# EAGLE design mini64-v0.9.8 (EAGLE 5.11)
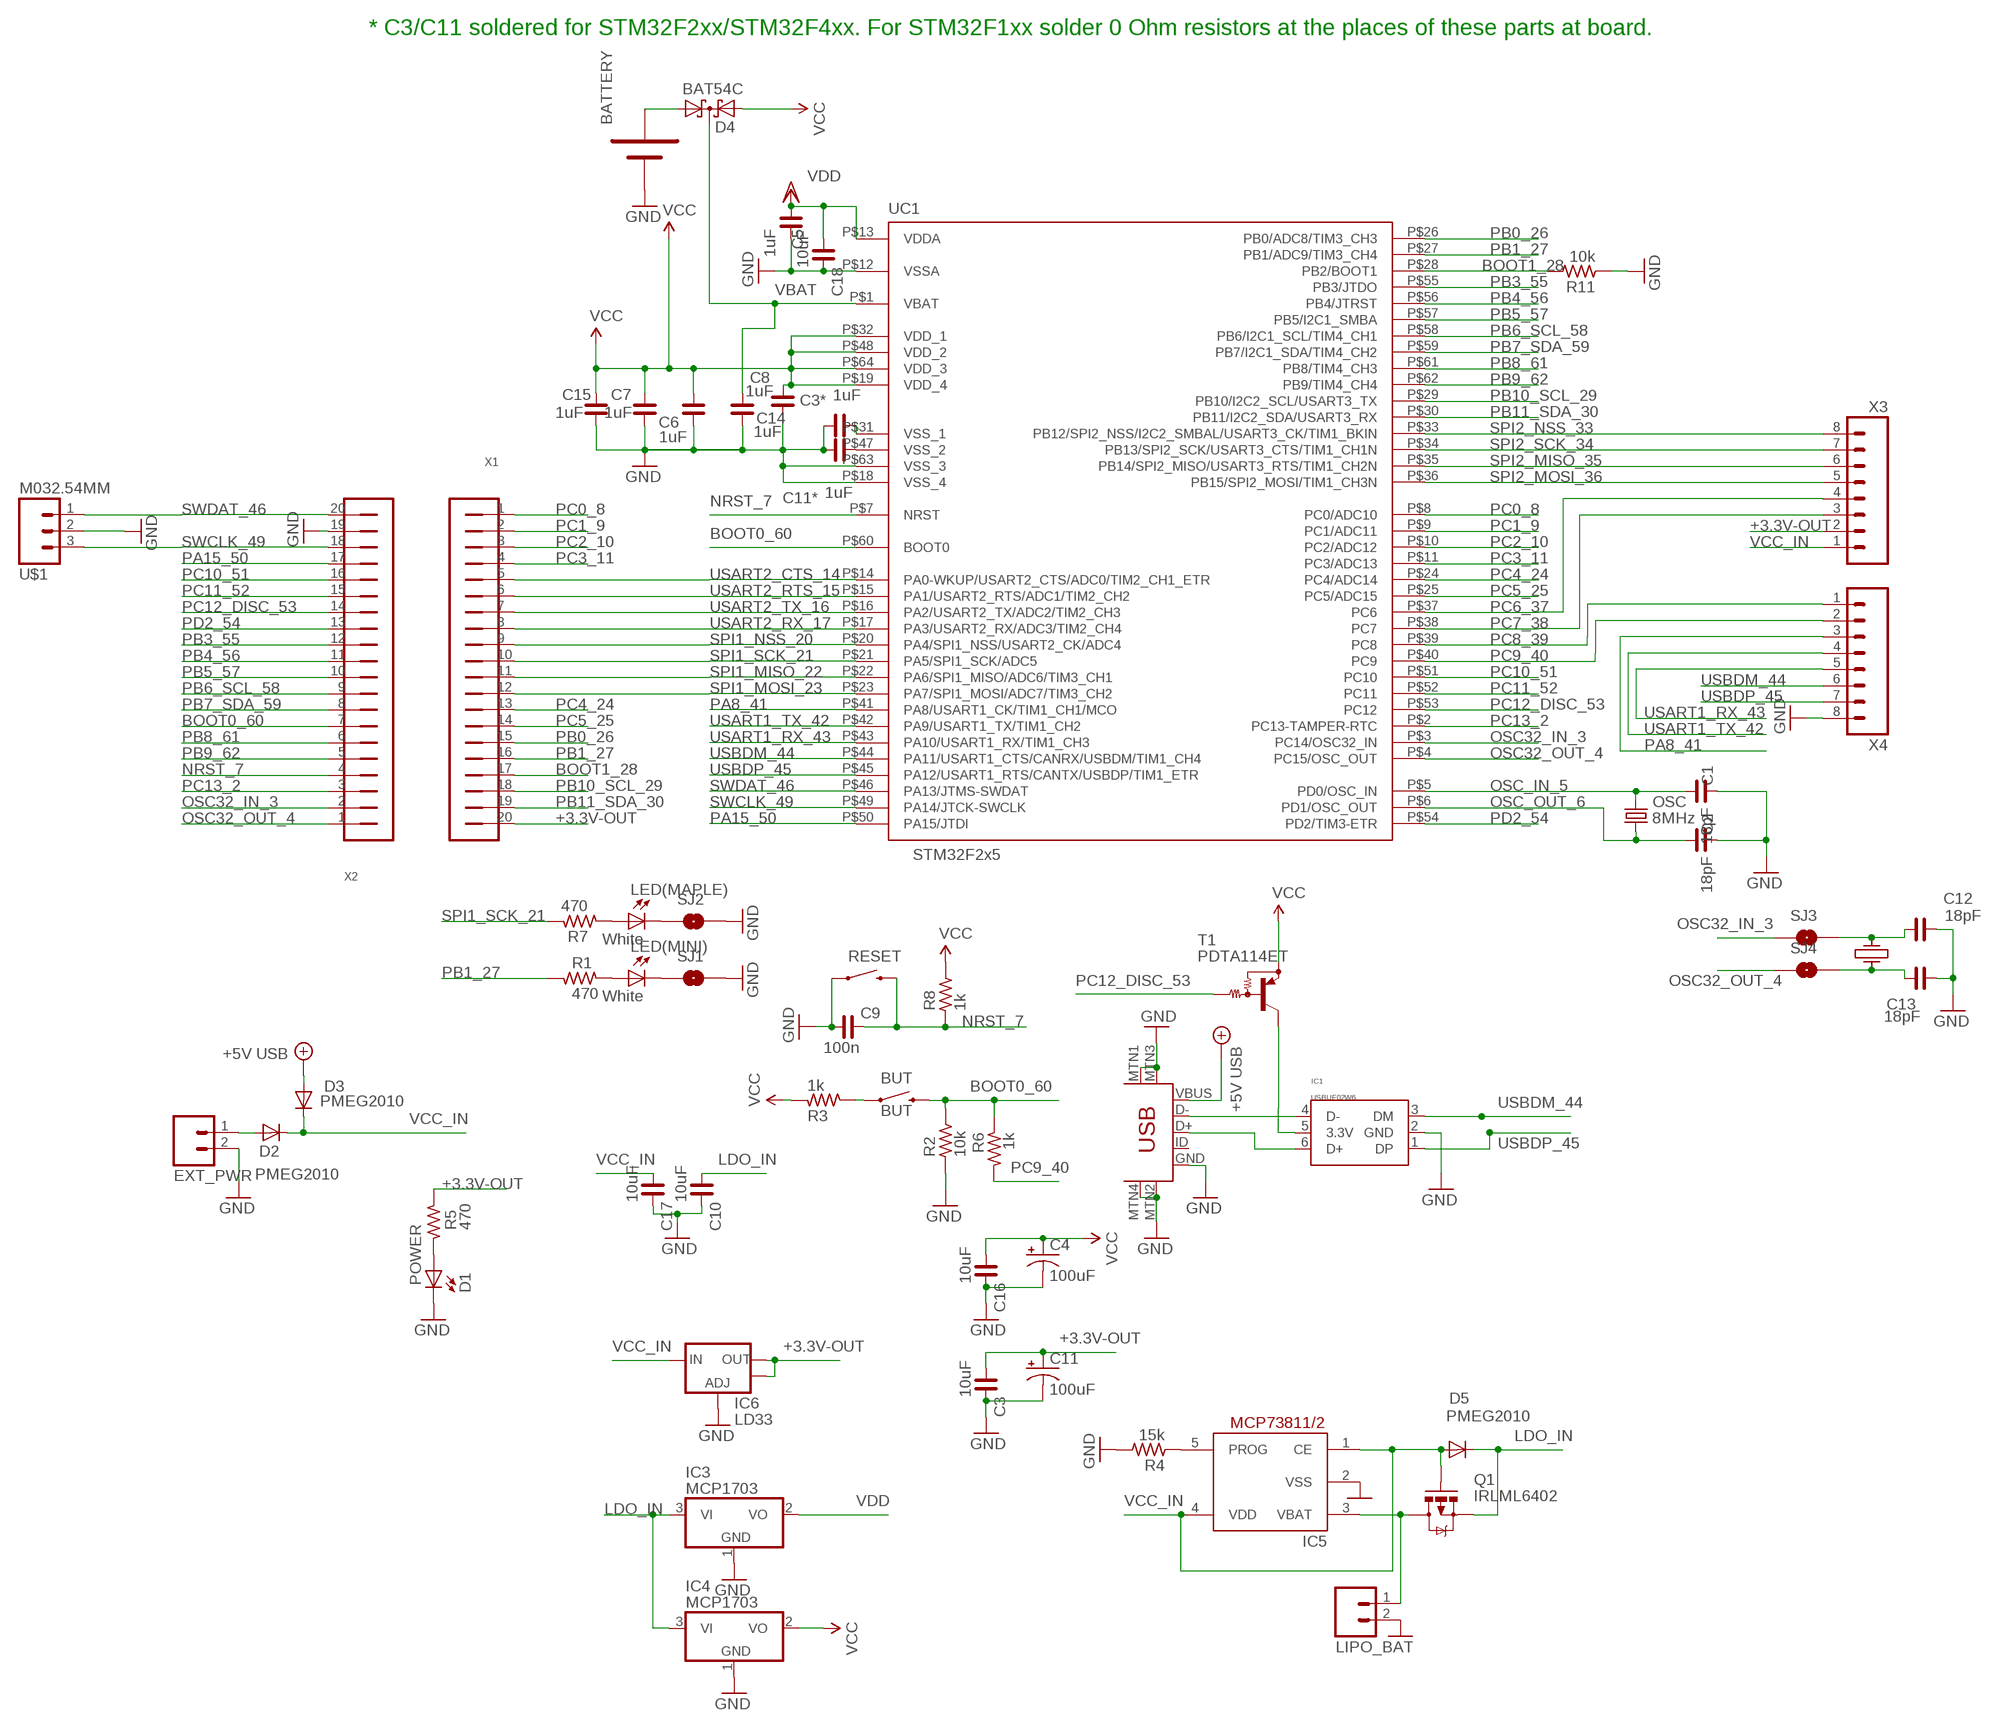
[diagram p0: schematic, sheet 1]

## Parts
BATTERY  BATTERY-1XAA20MM  [BATTCOM_20MM_PTH]
BUT  BUT  SWITCH-MOMENTARY-2-SMD-1101NE  [TACTILE-SWITCH-1101NE]
C1  18pF  C_0603  [C0603]
C2  18pF  C_0603  [C0603]
C3  10uF  C_0805  [C0805]
C3*  1uF  C_0603  [C0603]
C4  100uF  CAP_POL3528  [EIA3528]
C5  1uF  C_0603  [C0603]
C6  1uF  C_0603  [C0603]
C7  1uF  C_0603  [C0603]
C8  1uF  C_0603  [C0603]
C9  100n  C_0603  [C0603]
C10  10uF  C_0805  [C0805]
C11  100uF  CAP_POL3528  [EIA3528]
C11*  1uF  C_0603  [C0603]
C12  18pF  C_0603  [C0603]
C13  18pF  C_0603  [C0603]
C14  1uF  C_0603  [C0603]
C15  1uF  C_0603  [C0603]
C16  10uF  C_0805  [C0805]
C17  10uF  C_0805  [C0805]
C18  10uF  C_0805  [C0805]
D1  POWER  LEDCHIP-LED0603  [CHIP-LED0603]
D2  PMEG2010  DIODESOD-323  [SOD-323]
D3  PMEG2010  DIODESOD-323  [SOD-323]
D4  BAT54C  BAT54CRS  [SOT23-3]
D5  PMEG2010  DIODESOD-323  [SOD-323]
EXT_PWR  M021X02_NO_SILK  [1X02_NO_SILK]
IC1  USBUF02W6  [SC70-6]
IC3  MCP1703  [SOT23-3]
IC4  MCP1703  [SOT23-3]
IC5  MCP73811/2  [SOT23-5L]
IC6  LD33  V_REG_LM1117SOT223  [SOT223]
LED(MAPLE)  White  LEDCHIP-LED0603  [CHIP-LED0603]
LED(MINI)  White  LEDCHIP-LED0603  [CHIP-LED0603]
LIPO_BAT  M021X02_NO_SILK  [1X02_NO_SILK]
OSC  8MHz  CRYSTAL5X3  [CRYSTAL-SMD-5X3]
OSC2  32768kHz  CRYSTALL  [KX-327LT]
Q1  IRLML6402  MOSFET-PCHANNELSMD  [SOT23-3]
R1  470  R_0603  [R0603]
R2  10k  R_0603  [R0603]
R3  1k  R_0603  [R0603]
R4  15k  R_0603  [R0603]
R5  470  R_0603  [R0603]
R6  1k  R_0603  [R0603]
R7  470  R_0603  [R0603]
R8  1k  R_0603  [R0603]
R11  10k  R_0603  [R0603]
RESET  SWITCH-MOMENTARY-2-SMD-1101NE  [TACTILE-SWITCH-1101NE]
SJ1  SOLDERJUMPERTRACE  [SJ_2S-TRACE]
SJ2  SOLDERJUMPERTRACE  [SJ_2S-TRACE]
SJ3  SOLDERJUMPERTRACE  [SJ_2S-TRACE]
SJ4  SOLDERJUMPERTRACE  [SJ_2S-TRACE]
T1  PDTA114ET  PNP-DRIVERSOT23-3  [SOT23-3]
U$1  M032.54MM  M031X03_NO_SILK  [1X03_NO_SILK]
UC1  STM32F2x5  STM32F103  [TQFP-10X10-64]
USB  USB-MINIB-5PIN  [USB-MINIB]
X1  M20NO_SILK  [1X20_NO_SILK]
X2  M20NO_SILK  [1X20_NO_SILK]
X3  M08  [1X08-NOSILK]
X4  M08  [1X08-NOSILK]

## Nets
+3.3V-OUT [vcc]: C3.1 C11.A(+) IC6.2(OUT) IC6.4(OUT) R5.1 X1.20 X3.2
+5V [vcc]: D3.A USB.VBUS ; supply symbol labelled +5V USB
BOOT0_60: BUT.P$2 R2.2 R6.1 UC1.P$60(BOOT0) X2.7
BOOT1_28: R11.2 UC1.P$28(PB2/BOOT1) X1.17
GND [vcc]: BATTERY.- C1.1 C2.1 C3*.2 C3.2 C4.C(-) C5.1 C6.1 C7.1 C8.1 C9.1 C10.2 C11*.2 C11.C(-) C12.1 C13.1 C14.1 C15.1 C16.2 C17.2 C18.2 D1.C EXT_PWR.2 IC1.2(GND) IC3.1(GND) IC4.1(GND) IC5.2(VSS) IC6.1(ADJ) LIPO_BAT.2 R2.1 R4.2 R11.1 RESET.P$1 SJ1.2 SJ2.2 U$1.2 UC1.P$12(VSSA) UC1.P$18(VSS_4) UC1.P$63(VSS_3) USB.GND USB.MTN1(MTN2) USB.MTN2(MTN3) USB.MTN3(MTN1) USB.MTN4 X2.19 X4.8
LDO_IN [vcc]: C10.1 D5.C IC3.3(VI) IC4.3(VI) Q1.2(S)
N$1: D1.A R5.2
N$2: BUT.P$1 R3.2
N$3: LED(MINI).A R1.1
N$4: LED(MINI).C SJ1.1
N$5: LED(MAPLE).A R7.2
N$6: LED(MAPLE).C SJ2.1
N$7: C11*.1 UC1.P$47(VSS_2)
N$8: BATTERY.+ D4.1(A1)
N$9: C3*.1 UC1.P$31(VSS_1)
N$10: C13.2 OSC2.4 SJ4.2
N$11 [vcc]: D2.A EXT_PWR.1
N$12: C12.2 OSC2.1 SJ3.2
N$13: IC5.5(PROG) R4.1
N$14: IC1.4(D-) USB.D-
N$16 [vcc]: IC5.3(VBAT) LIPO_BAT.1 Q1.3(D)
N$17: IC1.6(D+) USB.D+
N$51: IC1.5(3.3V) T1.3(C)
NRST_7: C9.2 R8.1 RESET.P$2 UC1.P$7(NRST) X2.4
OSC32_IN_3: SJ3.1 UC1.P$3(PC14/OSC32_IN) X2.2
OSC32_OUT_4: SJ4.1 UC1.P$4(PC15/OSC_OUT) X2.1
OSC_IN_5: C1.2 OSC.3 UC1.P$5(PD0/OSC_IN)
OSC_OUT_6: C2.2 OSC.1 UC1.P$6(PD1/OSC_OUT)
PA8_41: UC1.P$41(PA8/USART1_CK/TIM1_CH1/MCO) X4.3
PA15_50: UC1.P$50(PA15/JTDI) X2.17
PB0_26: UC1.P$26(PB0/ADC8/TIM3_CH3) X1.15
PB1_27: R1.2 UC1.P$27(PB1/ADC9/TIM3_CH4) X1.16
PB3_55: UC1.P$55(PB3/JTDO) X2.12
PB4_56: UC1.P$56(PB4/JTRST) X2.11
PB5_57: UC1.P$57(PB5/I2C1_SMBA) X2.10
PB6_SCL_58: UC1.P$58(PB6/I2C1_SCL/TIM4_CH1) X2.9
PB7_SDA_59: UC1.P$59(PB7/I2C1_SDA/TIM4_CH2) X2.8
PB8_61: UC1.P$61(PB8/TIM4_CH3) X2.6
PB9_62: UC1.P$62(PB9/TIM4_CH4) X2.5
PB10_SCL_29: UC1.P$29(PB10/I2C2_SCL/USART3_TX) X1.18
PB11_SDA_30: UC1.P$30(PB11/I2C2_SDA/USART3_RX) X1.19
PC0_8: UC1.P$8(PC0/ADC10) X1.1
PC1_9: UC1.P$9(PC1/ADC11) X1.2
PC2_10: UC1.P$10(PC2/ADC12) X1.3
PC3_11: UC1.P$11(PC3/ADC13) X1.4
PC4_24: UC1.P$24(PC4/ADC14) X1.13
PC5_25: UC1.P$25(PC5/ADC15) X1.14
PC6_37: UC1.P$37(PC6) X3.4
PC7_38: UC1.P$38(PC7) X3.3
PC8_39: UC1.P$39(PC8) X4.1
PC9_40: R6.2 UC1.P$40(PC9) X4.2
PC10_51: UC1.P$51(PC10) X2.16
PC11_52: UC1.P$52(PC11) X2.15
PC12_DISC_53: T1.1(B) UC1.P$53(PC12) X2.14
PC13_2: UC1.P$2(PC13-TAMPER-RTC) X2.3
PD2_54: UC1.P$54(PD2/TIM3-ETR) X2.13
SPI1_MISO_22: UC1.P$22(PA6/SPI1_MISO/ADC6/TIM3_CH1) X1.11
SPI1_MOSI_23: UC1.P$23(PA7/SPI1_MOSI/ADC7/TIM3_CH2) X1.12
SPI1_NSS_20: UC1.P$20(PA4/SPI1_NSS/USART2_CK/ADC4) X1.9
SPI1_SCK_21: R7.1 UC1.P$21(PA5/SPI1_SCK/ADC5) X1.10
SPI2_MISO_35: UC1.P$35(PB14/SPI2_MISO/USART3_RTS/TIM1_CH2N) X3.6
SPI2_MOSI_36: UC1.P$36(PB15/SPI2_MOSI/TIM1_CH3N) X3.5
SPI2_NSS_33: UC1.P$33(PB12/SPI2_NSS/I2C2_SMBAL/USART3_CK/TIM1_BKIN) X3.8
SPI2_SCK_34: UC1.P$34(PB13/SPI2_SCK/USART3_CTS/TIM1_CH1N) X3.7
SWCLK_49: U$1.3 UC1.P$49(PA14/JTCK-SWCLK) X2.18
SWDAT_46: U$1.1 UC1.P$46(PA13/JTMS-SWDAT) X2.20
USART1_RX_43: UC1.P$43(PA10/USART1_RX/TIM1_CH3) X4.5
USART1_TX_42: UC1.P$42(PA9/USART1_TX/TIM1_CH2) X4.4
USART2_CTS_14: UC1.P$14(PA0-WKUP/USART2_CTS/ADC0/TIM2_CH1_ETR) X1.5
USART2_RTS_15: UC1.P$15(PA1/USART2_RTS/ADC1/TIM2_CH2) X1.6
USART2_RX_17: UC1.P$17(PA3/USART2_RX/ADC3/TIM2_CH4) X1.8
USART2_TX_16: UC1.P$16(PA2/USART2_TX/ADC2/TIM2_CH3) X1.7
USBDM_44: IC1.3(DM) UC1.P$44(PA11/USART1_CTS/CANRX/USBDM/TIM1_CH4) X4.6
USBDP_45: IC1.1(DP) UC1.P$45(PA12/USART1_RTS/CANTX/USBDP/TIM1_ETR) X4.7
VBAT: C8.2 D4.3(CC) UC1.P$1(VBAT)
VCC [vcc]: C4.A(+) C6.2 C7.2 C14.2 C15.2 C16.1 D4.2(A2) IC4.2(VO) R3.1 R8.2 T1.2(E) UC1.P$19(VDD_4) UC1.P$32(VDD_1) UC1.P$48(VDD_2) UC1.P$64(VDD_3)
VCC_IN [vcc]: C17.1 D2.C D3.C D5.A IC5.1(CE) IC5.4(VDD) IC6.3(IN) Q1.1(G) X3.1
VDD [vcc]: C5.2 C18.1 IC3.2(VO) UC1.P$13(VDDA)
Unconnected: USB.ID

## Notes on the sheet
- * C3/C11 soldered for STM32F2xx/STM32F4xx. For STM32F1xx solder 0 Ohm resistors at the places of these parts at board.

## Library data of the parts
BATTERY = es:BATTERY-1XAA
BUT RESET = SparkFun_20110922_my:SWITCH-MOMENTARY-2
C1-C3 C3* C5-C10 C11* C12-C18 = rc-master-smd:C_: NON-POLARIZED CAP
C4 C11 = SparkFun_20110922_my:CAP_POL: Capacitor Polarized These are standard SMD and PTH capacitors. Normally 10uF, 47uF, and 100uF in electrolytic and tantalum varieties. Always verify the external diameter of the through hole cap, it varies with capacity, voltage, and manufacturer. The EIA devices should be standard.
D1 LED(MAPLE) LED(MINI) = led:LED: LED OSRAM: - CHIPLED LG R971, LG N971, LY N971, LG Q971, LY Q971, LO R971, LY R971 LH N974, LH R974 LS Q976, LO Q976, LY Q976 LO Q996 - Hyper CHIPLED LW Q18S LB Q993, LB Q99A, LB R99A - SideLED LS A670, LO A670, LY A670, LG A670, LP A670 LB A673, LV A673, LT A673, LW A673 LH A674 LY A675 LS A676, LA A676, LO A676, LY A676, LW A676 LS A679, LY A679, LG A679 - Hyper Micro SIDELED® LS Y876, LA Y876, LO Y876, LY Y876 LT Y87S - SmartLED LW L88C, LW L88S LB L89C, LB L89S, LG L890 LS L89K, LO L89K, LY L89K LS L896, LA L896, LO L896, LY L896 - TOPLED LS T670, LO T670, LY T670, LG T670, LP T670 LSG T670, LSP T670, LSY T670, LOP T670, LYG T670 LG T671, LOG T671, LSG T671 LB T673, LV T673, LT T673, LW T673 LH T674 LS T676, LA T676, LO T676, LY T676, LB T676, LH T676, LSB T676, LW T676 LB T67C, LV T67C, LT T67C, LS T67K, LO T67K, LY T67K, LW E67C LS E67B, LA E67B, LO E67B, LY E67B, LB E67C, LV E67C, LT E67C LW T67C LS T679, LY T679, LG T679 LS T770, LO T770, LY T770, LG T770, LP T770 LB T773, LV T773, LT T773, LW T773 LH T774 LS E675, LA E675, LY E675, LS T675 LS T776, LA T776, LO T776, LY T776, LB T776 LHGB T686 LT T68C, LB T68C - Hyper Mini TOPLED® LB M676 - Mini TOPLED Santana® LG M470 LS M47K, LO M47K, LY M47K Source: http://www.osram.convergy.de LUXEON: - LUMILED® LXK2-PW12-R00, LXK2-PW12-S00, LXK2-PW14-U00, LXK2-PW14-V00 LXK2-PM12-R00, LXK2-PM12-S00, LXK2-PM14-U00 LXK2-PE12-Q00, LXK2-PE12-R00, LXK2-PE12-S00, LXK2-PE14-T00, LXK2-PE14-U00 LXK2-PB12-K00, LXK2-PB12-L00, LXK2-PB12-M00, LXK2-PB14-N00, LXK2-PB14-P00, LXK2-PB14-Q00 LXK2-PR12-L00, LXK2-PR12-M00, LXK2-PR14-Q00, LXK2-PR14-R00 LXK2-PD12-Q00, LXK2-PD12-R00, LXK2-PD12-S00 LXK2-PH12-R00, LXK2-PH12-S00 LXK2-PL12-P00, LXK2-PL12-Q00, LXK2-PL12-R00 Source: www.luxeon.com KINGBRIGHT: KA-3528ASYC Source: www.kingbright.com
D2 D3 D5 = adafruit:DIODE: Diode SMADIODE - SMA Surface Mount Package 20V 1A Schottky Diode Digikey: 641-1014-6-ND DO-1N4148 - Through Hole Small Current Diode SOD-123 20V 1 A (.5mV Vf) Schottky Diode - Digikey: MBRX120TPMSCT-ND SOD-323 10V 570mA (.38mV Vf, 3ns) Schottky Diode - Digikey: ZLLS410CT-ND SOD-523 30V 30mA Schottky Diode (RB751S-40TE61) - Digikey: RB751S-40TE61CT-ND SOT23-R/W - SOT23 Package (R = Solder Paste/Reflow Ovens, W = Hand-Soldering) BAT54Film 40V 300mA - Digikey: 497-7162-1-ND
D4 = es:BAT54C: Schottky Diodes Source: Fairchild .. BAT54.pdf
EXT_PWR LIPO_BAT = SparkFun_20110922_my:M02: Header 2 Standard 2-pin 0.1" header. Use with straight break away headers (SKU : PRT-00116), right angle break away headers (PRT-00553), swiss pins (PRT-00743), machine pins (PRT-00117), and female headers (PRT-00115). Molex polarized connector foot print use with SKU : PRT-08233 with associated crimp pins and housings.
IC1 = es:USBUF
IC3 IC4 = es:MCP1703: 250 mA, 16V, Low Quiescent Current LDO Regulator Source: http://ww1.microchip.com/downloads/en/DeviceDoc/22049b.pdf
IC5 = adafruit_my:MCP73811/2: MCP73811 and MCP73812 Simple, Miniature Single-Cell, Fully Integrated Li-Ion / Li-Polymer Charge Management Controllers SOT-23-5 package, no indicator LED but with adjustable current, small and very inexpensive
IC6 = SparkFun_20110922_my:V_REG_LM1117: Voltage Regulator LM1117 Standard adjustable voltage regulator but in SMD form. Spark Fun Electronics SKU : COM-00595
OSC = SparkFun:CRYSTAL: Crystals Various standard crystals. Proven footprints. Spark Fun Electronics SKU : COM-00534
OSC2 = es:CRYSTALL
Q1 = es:MOSFET-PCHANNEL
R1-R8 R11 = rc-master-smd:R_: RESISTOR
SJ1-SJ4 = es:SOLDERJUMPER: Solder Jumper Standard SMD solder jumper. Used to automate production. Two varients : Normally Open and Normally Closed are the same, but have different paste layers. NC will have a large amount of paste and should jumper during reflow.
T1 = es:PNP-DRIVER
U$1 = SparkFun_20110922_my:M03: Header 3 Standard 3-pin 0.1" header. Use with straight break away headers (SKU : PRT-00116), right angle break away headers (PRT-00553), swiss pins (PRT-00743), machine pins (PRT-00117), and female headers (PRT-00115). Molex polarized connector foot print use with SKU : PRT-08232 with associated crimp pins and housings.
UC1 = st-microelectronics:STM32F103
USB = SparkFun_20110922_my:USB-MINIB: Mini-USB "B" connector with 5th pin broken out. Created new symbol breaking out 5th "ID" pin in mini/micro USB connector spec. See: http://en.wikipedia.org/wiki/Mini_usb#Cables. Uses same footprint as 4-pin symbol. Also added pins to connect to mounting / shield pads if required (probably not generally needed as signals aren't shielded once they leave the connector).
X1 X2 = es:M20
X3 X4 = SparkFun_20110922_my:M08: Header 8 Standard 8-pin 0.1" header. Use with straight break away headers (SKU : PRT-00116), right angle break away headers (PRT-00553), swiss pins (PRT-00743), machine pins (PRT-00117), and female headers (PRT-00115).

## Net classes
1 vcc: width 0.3 mm

## Board
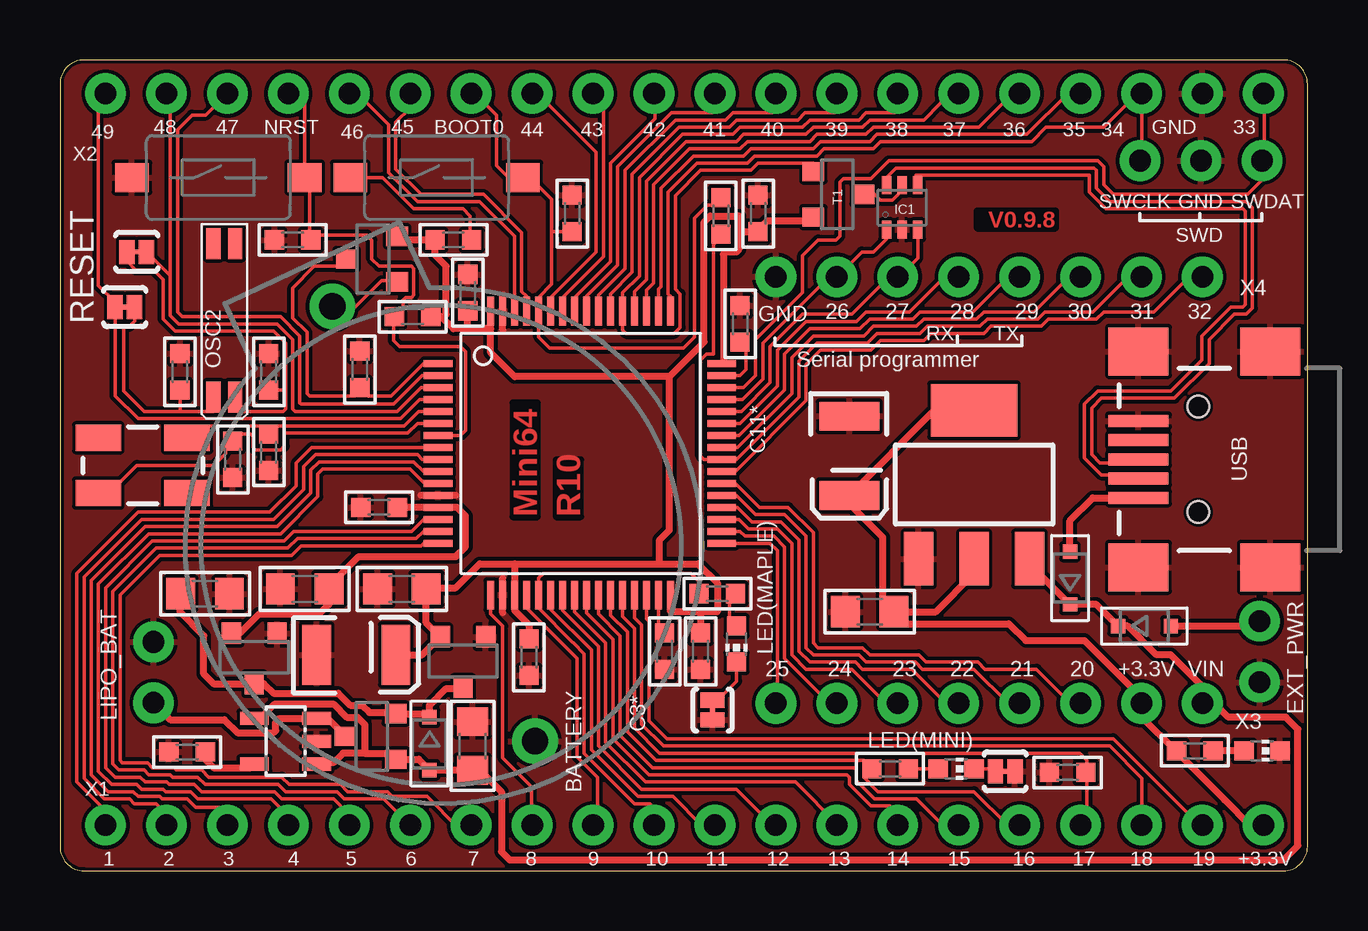
[diagram p1: board, top side]

Size 52 x 33.8 mm. Coordinates in mm from the lower left corner, seen from the top.
Outline: 51,0 arc90 52,1 52,32.8 arc90 51,33.8 1,33.8 arc90 0,32.8 0,1 arc90 1,0 51,0
Copper layers (1*16): Top 0.018mm / dielectric 1.5mm / Bottom 0.018mm
Design rules "es-015mm *": minimum track width 0.15mm, minimum drill 0.4mm, track to track 0.15mm, track to pad 0.15mm, pad to pad 0.15mm, via to via 0.15mm, smd to smd 0.15mm, copper to edge 0.15mm, drill to drill 0.15mm, minimum pad ring 0.4mm, minimum via ring 0.3mm, stop-mask expansion 0mil, vias tented up to drill 25mil, thermal gap 0.15mm

### Footprints (pad centres in the part's own frame; a part is rotated, then mirrored left to right if it is on the bottom)
BATTCOM_20MM_PTH = drill 1.1 round: + 20,0; - 0,0
TACTILE-SWITCH-1101NE = smd 1.4 x 1.2: P$1 -3.6,0; P$2 3.6,0
C0603 = smd 0.8 x 0.8: 1 -0.762,0; 2 0.762,0
C0805 = smd 1.2 x 1.3: 1 -1.016,0; 2 1.016,0
EIA3528 = smd 1.2 x 2.5: A 1.65,0; C -1.65,0
CHIP-LED0603 = smd 0.8 x 0.8: A 0,-0.75; C 0,0.75
SOD-323 = smd 0.6 x 0.6: A 1.1,0; C -1.1,0
SOT23-3 = smd 0.8 x 0.9: 1 -0.95,-1; 2 0.95,-1; 3 0,1.1
1X02_NO_SILK = drill 0.9 round: 1 0,0; 2 2.54,0
SC70-6 = smd 0.4 x 0.75: 1 -0.65,-0.925; 2 0,-0.925; 3 0.65,-0.925; 4 0.65,0.925; 5 0,0.925; 6 -0.65,0.925
SOT23-5L = smd 0.55 x 1.2: 1 -0.95,-1.3; 2 0,-1.3; 3 0.95,-1.3; 4 0.95,1.3; 5 -0.95,1.3
SOT223 = smd 1.219 x 2.235: 1 -2.311,-3.099; 2 0,-3.099; 3 2.311,-3.099 | smd 3.6 x 2.2: 4 0,3.099
CRYSTAL-SMD-5X3 = smd 1.9 x 1.1: 1 -1.85,-1.15; 2 1.85,-1.15; 3 1.85,1.15; 4 -1.85,1.15
KX-327LT = smd 1.3 x 0.6: 1 -3.2,-0.5; 2 3.2,-0.5; 3 3.2,0.4; 4 -3.2,0.4
R0603 = smd 0.8 x 0.8: 1 -0.762,0; 2 0.762,0
SJ_2S-TRACE = smd 0.635 x 1: 1 -0.408,0; 2 0.408,0 | smd 0.406 x 0.203: P$1 0,0
1X03_NO_SILK = drill 0.9 round: 1 0,0; 2 2.54,0; 3 5.08,0
TQFP-10X10-64 = smd 1.2 x 0.3: P$1 -5.936,3.75; P$2 -5.936,3.25; P$3 -5.936,2.75; P$4 -5.936,2.25; P$5 -5.936,1.75; P$6 -5.936,1.25; P$7 -5.936,0.75; P$8 -5.936,0.25; P$9 -5.936,-0.25; P$10 -5.936,-0.75; P$11 -5.936,-1.25; P$12 -5.936,-1.75; P$13 -5.936,-2.25; P$14 -5.936,-2.75; P$15 -5.936,-3.25; P$16 -5.936,-3.75; P$33 5.886,-3.75; P$34 5.886,-3.25; P$35 5.886,-2.75; P$36 5.886,-2.25; P$37 5.886,-1.75; P$38 5.886,-1.25; P$39 5.886,-0.75; P$40 5.886,-0.25; P$41 5.886,0.25; P$42 5.886,0.75; P$43 5.886,1.25; P$44 5.886,1.75; P$45 5.886,2.25; P$46 5.886,2.75; P$47 5.886,3.25; P$48 5.886,3.75 | smd 0.3 x 1.2: P$17 -3.75,-5.911; P$18 -3.25,-5.911; P$19 -2.75,-5.911; P$20 -2.25,-5.911; P$21 -1.75,-5.911; P$22 -1.25,-5.911; P$23 -0.75,-5.911; P$24 -0.25,-5.911; P$25 0.25,-5.911; P$26 0.75,-5.911; P$27 1.25,-5.911; P$28 1.75,-5.911; P$29 2.25,-5.911; P$30 2.75,-5.911; P$31 3.25,-5.911; P$32 3.75,-5.911; P$49 3.75,5.936; P$50 3.25,5.936; P$51 2.75,5.936; P$52 2.25,5.936; P$53 1.75,5.936; P$54 1.25,5.936; P$55 0.75,5.936; P$56 0.25,5.936; P$57 -0.25,5.936; P$58 -0.75,5.936; P$59 -1.25,5.936; P$60 -1.75,5.936; P$61 -2.25,5.936; P$62 -2.75,5.936; P$63 -3.25,5.936; P$64 -3.75,5.936
USB-MINIB = smd 2.5 x 0.5: D+ 2.5,0; D- 2.5,0.8; GND 2.5,-1.6; ID 2.5,-0.8; VBUS 2.5,1.6 | smd 2.5 x 2: MTN1 -3,4.5; MTN2 2.5,4.5; MTN3 -3,-4.5; MTN4 2.5,-4.5 | hole 0.9: 0,2.2; 0,-2.2
1X20_NO_SILK = drill 0.9 round: 1 0,0; 2 2.54,0; 3 5.08,0; 4 7.62,0; 5 10.16,0; 6 12.7,0; 7 15.24,0; 8 17.78,0; 9 20.32,0; 10 22.86,0; 11 25.4,0; 12 27.94,0; 13 30.48,0; 14 33.02,0; 15 35.56,0; 16 38.1,0; 17 40.64,0; 18 43.18,0; 19 45.72,0; 20 48.26,0
1X08-NOSILK = drill 0.9 round: 1 0,0; 2 2.54,0; 3 5.08,0; 4 7.62,0; 5 10.16,0; 6 12.7,0; 7 15.24,0; 8 17.78,0

### Placement (x,y rotation side)
BATTERY  19.8,5.4 115 top
BUT  15.7,28.9 0 top
C1  8.7,17.45 90 top
C2  7.2,17.15 90 top
C3  33.75,10.8 180 top
C3*  25.2,9.15 270 top
C4  12.35,9 0 top
C5  13.3,15.15 0 top
C6  29.1,27.4 270 top
C7  26.7,9.15 90 top
C8  12.5,20.9 270 top
C9  9.7,26.3 0 top
C10  6.05,11.55 0 top
C11  32.9,17.3 270 top
C11*  28.35,22.8 90 top
C12  8.7,20.8 270 top
C13  5,20.8 270 top
C14  17,24.1 270 top
C15  19.55,8.9 90 top
C16  14.25,11.75 180 top
C17  17.2,5.2 90 top
C18  10.2,11.75 180 top
D1  50.1,5 270 top
D2  45.2,10.2 0 top
D3  42.1,12.2 90 top
D4  13.05,25.5 90 top
D5  15.4,5.3 270 top
EXT_PWR  50,10.4 270 top
IC1  35.1,27.65 0 top
IC3  8.1,8.9 180 top
IC4  16.8,8.75 180 top
IC5  9.4,5.4 90 top
IC6  38.1,16.1 0 top
LED(MAPLE)  28.2,9.45 180 top
LED(MINI)  37.35,4.25 270 top
LIPO_BAT  3.9,7 90 top
OSC  3.45,16.9 0 top
OSC2  6.8,22.95 90 top
Q1  13,5.6 90 top
R1  34.6,4.25 180 top
R2  21.35,27.4 270 top
R3  16.4,26.3 0 top
R4  5.3,4.95 180 top
R5  47.3,5 0 top
R6  27.55,27.3 270 top
R7  27.4,11.55 0 top
R8  14.7,23.1 0 top
R11  42,4.1 0 top
RESET  6.6,28.9 0 top
SJ1  39.4,4.15 0 top
SJ2  27.2,6.7 270 top
SJ3  3.2,25.8 180 top
SJ4  2.7,23.5 0 top
T1  32.4,28.2 270 top
U$1  50.1,29.6 180 top
UC1  21.7,17.4 0 top
USB  47.45,17.15 180 top
X1  1.9,1.9 0 top
X2  1.9,32.4 0 top
X3  47.62,6.98 180 top
X4  47.62,24.76 180 top

### Tracks (layer width: path | path; a pad name or v marks a point on that pad's centre or on a via)
+3.3V-OUT
  Top 0.3: 46.5,5 45.08,6.42 X3.2 45.08,7.22 45,7.3 42.7,9.6 40.25,9.6 39.55,10.3 35.27,10.3 C3.1 | 46.5,5 48.55,2.95 49.6,1.9 X1.20 | IC6.4 36.45,19.2 C11.A 32.9,15.3 34.3,13.9 34.3,11.27 C3.1 | C3.1 36.5,10.8 38.1,12.4 IC6.2 | 46.5,5 R5.1
+5V
  Top 0.3: USB.VBUS 43.05,15.55 42.1,14.6 D3.A
BOOT0_60
  Top 0.15: R6.1 27.29,27.8 27.29,27.75 27,27.75 26.45,27.2 26.45,22.25 26,21.8 20.4,21.8 19.95,22.25 UC1.P$60 19.95,23.9 20.5,24.45 20.5,26.6 | 20.5,26.6 20.5,28 19.6,28.9 BUT.P$2 18.7,28.9 18.2,29.4 18.2,31.5 17.3,32.4 X2.7 | R2.2 20.54,26.64 20.5,26.6
BOOT1_28
  Top 0.15: UC1.P$28 23.45,10.6 23.95,10.1 23.95,5.95 25,4.9 28.6,4.9 42.5,4.9 42.8,4.6 42.8,4.1 | 42.8,4.1 42.8,1.9 X1.17 | 42.8,4.1 R11.2
GND
  Top 0.3: 18.45,10.75 18.45,12.2 | 18.45,22.55 18.45,24 | 16.5,15.65 15.05,15.65
  pour Top (isolate 0.12): -0.05,34.55 -0.05,-0.05 52.35,-0.05 52.35,34.55
LDO_IN
  Top 0.3: IC4.3 16.75,7.6 16.1,7.6 15.4,6.9 D5.C 15.25,6.55 Q1.2 13.95,6.6 12.9,6.6 12.6,6.9 12.1,6.9 11.6,7.4 8.9,7.4 8.5,7.8 IC3.3 6.4,7.8 6,8.2 6,9.8 5,10.8 5,11.52 C10.1
N$1
  Top 0.3: D1.A R5.2
N$2
  Top 0.15: BUT.P$1 13.45,28.9 14.75,27.6 16.8,27.6 17.1,27.3 17.1,26.36 R3.2
N$3
  Top 0.15: R1.1 LED(MINI).A
N$4
  Top 0.15: LED(MINI).C 39.09,4.25 SJ1.1
N$5
  Top 0.15: LED(MAPLE).A 28.1,10.2 27.9,10.4 27.9,11.29 R7.2
N$6
  Top 0.15: SJ2.1 27.41,7.11 28.2,7.9 LED(MAPLE).C
N$7
  Top 0.15: UC1.P$47 28.35,20.65 28.6,20.9 28.6,21.79 C11*.1
N$8
  Top 0.15: BATTERY.+ 12.33,23.53 13.4,24.6 14,24.6 D4.1
N$9
  Top 0.15: UC1.P$31 24.95,10.16 C3*.1
N$10
  Top 0.15: SJ4.2 3.11,22.91 2.9,22.7 2.65,22.7 2.65,20 3.5,19.15 5,19.15 | 5,19.15 6.4,19.15 OSC2.4 | 5,19.15 C13.2
N$11
  Top 0.3: D2.A 49.8,10.2 EXT_PWR.1
N$12
  Top 0.15: SJ3.2 2.79,25.41 3.15,25.05 3.9,25.05 4.3,24.65 4.3,23 4.8,22.5 8.9,22.5 9.4,22 9.4,20.1 | 9.4,20.1 9.4,19.25 9.3,19.15 7.4,19.15 7.3,19.25 OSC2.1 | C12.2 9.34,20.04 9.4,20.1
N$13
  Top 0.3: R4.1 6.06,4.64 6.4,4.3 7.95,4.3 IC5.5
N$14
  Top 0.15: USB.D- 43.95,16.35 43.8,16.5 43.4,16.5 42.7,17.2 42.7,19.45 43.25,20 46.3,20 47.6,21.3 47.6,22.3 48.8,23.5 49.3,23.5 49.4,23.6 49.4,27.5 49.3,27.6 43.6,27.6 42.9,28.3 42.9,29 35.67,29 35.67,28.65 IC1.4
N$16
  Top 0.3: Q1.3 11.15,6.35 IC5.3 9.15,6.35 9,6.2 9,5.85 8.9,5.75 7.4,5.75 6.85,6.3 4.6,6.3 LIPO_BAT.1
N$17
  Top 0.15: USB.D+ 44.05,17.15 43.9,17 43.35,17 43,17.35 43,19.3 43.4,19.7 46.45,19.7 47.9,21.15 47.9,22.15 48.95,23.2 49.45,23.2 49.7,23.45 49.7,27.65 49.45,27.9 43.75,27.9 43.2,28.45 43.2,29.2 43.1,29.3 34.85,29.3 34.45,28.9 IC1.6
N$51
  Top 0.15: T1.3 33.95,28.2 34.2,27.95 34.7,27.95 35.1,28.35 IC1.5
NRST_7
  Top 0.15: UC1.P$7 16.7,18.15 16.9,18.35 16.9,21.65 16.7,21.85 14.15,21.85 13.9,22.1 13.9,23.06 R8.1 14.3,23.46 14.3,23.8 14.4,23.9 14.65,23.9 14.75,24 14.75,25.1 14.65,25.2 13.3,25.2 13,25.5 13,26.3 12.8,26.5 10.66,26.5 C9.2 10.4,26.36 10.4,28.7 RESET.P$2 10.2,32 9.8,32.4 X2.4
OSC32_IN_3
  Top 0.15: UC1.P$3 15.05,20.15 14.05,19.15 9.8,19.15 9.7,19.25 9.7,22.15 9.05,22.8 4.95,22.8 4.6,23.15 4.6,24.8 | 4.6,24.8 4.6,24.81 SJ3.1 | 4.6,24.8 4.6,32.2 4.44,32.36 X2.2
OSC32_OUT_4
  Top 0.15: UC1.P$4 15,19.65 14.2,18.85 3.25,18.85 2.3,19.8 SJ4.1 2.29,23.71 1.6,24.4 1.6,32.1 X2.1
OSC_IN_5
  Top 0.15: UC1.P$5 14.95,19.15 14.35,18.55 8.7,18.55 | 8.7,18.55 5.3,18.55 OSC.3 | 8.7,18.55 C1.2
OSC_OUT_6
  Top 0.15: UC1.P$6 14.9,18.65 14.5,18.25 9.35,18.25 9.35,17.7 9.2,17.55 8.15,17.55 8.05,17.65 8.05,18.1 7.95,18.2 7.49,18.2 C2.2 7.19,17.91 6.9,18.2 6.9,17.4 6.4,16.9 3.2,16.9 2.4,16.1 1.95,16.1 OSC.1
PA8_41
  Top 0.15: UC1.P$41 28.25,17.65 30.5,19.9 30.5,21.4 31.4,22.3 33.5,22.3 33.9,22.7 35.7,22.7 36,23 38.2,23 38.5,23.3 40.6,23.3 42.1,24.8 42.5,24.8 X4.3
PA15_50
  Top 0.15: UC1.P$50 24.95,24.25 25.05,24.35 25.05,28.45 26.4,29.8 28.5,29.8 28.8,30.1 31.4,30.1 31.7,30.4 33.75,30.4 34.05,30.7 40.3,30.7 42,32.4 X2.17
PB0_26
  Top 0.15: UC1.P$26 22.45,10.7 23.35,9.8 23.35,5.65 24.7,4.3 33.1,4.3 33.2,4.2 33.2,3.75 33.95,3 35.7,3 36.8,1.9 X1.15
PB1_27
  Top 0.15: UC1.P$27 22.95,10.65 23.65,9.95 23.65,5.8 24.85,4.6 33.5,4.6 33.5,4.2 | X1.16 39.5,1.9 38.1,3.3 34.1,3.3 33.5,3.9 33.5,4.2 | R1.2 33.55,4.25 33.5,4.2
PB3_55
  Top 0.15: UC1.P$55 22.45,24 23.55,25.1 23.55,29.2 25.65,31.3 27.75,31.3 28.05,31.6 29.7,31.6 29.8,31.7 29.8,32.36 X2.12
PB4_56
  Top 0.15: UC1.P$56 21.95,23.95 23.25,25.25 23.25,29.35 25.5,31.6 27.2,31.6 27.3,31.7 X2.11
PB5_57
  Top 0.15: UC1.P$57 21.45,23.9 22.95,25.4 22.95,29.5 24.8,31.35 24.8,32.34 24.8,32.36 X2.10
PB6_SCL_58
  Top 0.15: UC1.P$58 20.95,23.9 22.65,25.6 22.65,32.4 X2.9
PB7_SDA_59
  Top 0.15: UC1.P$59 20.45,23.9 22.35,25.8 22.35,29.95 19.9,32.4 X2.8
PB8_61
  Top 0.15: UC1.P$61 19.45,23.95 19.25,24.15 19.25,24.4 19.25,26.6 17.65,28.2 15.05,28.2 14,29.25 14,31.2 14.6,31.8 X2.6
PB9_62
  Top 0.15: UC1.P$62 18.95,24.25 18.95,26.45 17.5,27.9 14.9,27.9 13.7,29.1 13.7,31.1 12.4,32.4 X2.5
PB10_SCL_29
  Top 0.15: UC1.P$29 23.95,10.55 24.25,10.25 24.25,6.1 25.15,5.2 43.75,5.2 45.1,3.85 45.1,1.92 X1.18 45,1.9
PB11_SDA_30
  Top 0.15: UC1.P$30 24.45,10.5 24.55,10.4 24.55,6.25 25.3,5.5 43.9,5.5 47.5,1.9 X1.19
PC0_8
  Top 0.15: UC1.P$8 15.05,17.65 14.95,17.65 10.5,17.65 9.85,17 9.85,16.05 8.75,14.95 3.25,14.95 0.7,12.4 0.7,3.7 1.9,2.5 X1.1
PC1_9
  Top 0.15: UC1.P$9 15.1,17.15 14.9,17.35 10.65,17.35 10.15,16.85 10.15,15.9 8.9,14.65 3.4,14.65 1,12.25 1,3.85 1.85,3 2.9,3 3.1,2.8 4,2.8 4.4,2.4 4.4,1.94 X1.2
PC2_10
  Top 0.15: UC1.P$10 15.15,16.65 14.75,17.05 10.8,17.05 10.45,16.7 10.45,15.75 9.05,14.35 3.55,14.35 1.3,12.1 1.3,4 2,3.3 3.05,3.3 3.25,3.1 4.15,3.1 4.25,3 5.3,3 5.65,2.65 6.75,2.65 7,2.4 7,1.92 X1.3
PC3_11
  Top 0.15: UC1.P$11 15.2,16.15 14.6,16.75 10.95,16.75 10.75,16.55 10.75,15.6 9.2,14.05 3.7,14.05 1.6,11.95 1.6,4.15 2.15,3.6 3.2,3.6 3.4,3.4 4.3,3.4 4.4,3.3 5.45,3.3 5.75,3 8.8,3 9.5,2.3 9.5,1.92 X1.4
PC4_24
  Top 0.15: UC1.P$24 21.45,10.8 22.75,9.5 22.75,5.35 24.4,3.7 30.65,3.7 32.45,1.9 X1.13
PC5_25
  Top 0.15: UC1.P$25 21.95,10.75 23.05,9.65 23.05,5.5 24.55,4 32.8,4 32.9,3.9 32.9,3.6 33.8,2.7 34.6,2.7 34.75,2.55 34.75,1.9 X1.14
PC6_37
  Top 0.15: UC1.P$37 28.2,15.65 29,14.85 30.2,14.85 31.1,13.95 31.1,9.3 31.4,9 33.3,9 33.6,8.7 35.65,8.7 35.95,8.4 38.1,8.4 39.5,7 39.98,7 X3.4
PC7_38
  Top 0.15: UC1.P$38 28.15,16.15 29.15,15.15 30.35,15.15 31.4,14.1 31.4,9.5 31.6,9.3 33.45,9.3 33.75,9 35.8,9 36.1,8.7 38.25,8.7 38.55,8.4 40.7,8.4 42.1,7 42.52,7 X3.3
PC8_39
  Top 0.15: UC1.P$39 28.15,16.65 31.1,19.6 31.1,21.1 31.7,21.7 33.8,21.7 34.2,22.1 36,22.1 36.3,22.4 38.5,22.4 38.8,22.7 40.9,22.7 41.2,23 43.2,23 43.5,23.3 45.6,23.3 47.1,24.8 47.5,24.8 47.54,24.76 X4.1
PC9_40
  Top 0.15: R6.2 27.55,26.4 27.25,26.1 27.25,21.55 26.95,21.55 26.7,21.3 26.7,17.3 26.85,17.15 UC1.P$40 28.2,17.15 30.8,19.75 30.8,21.25 31.55,22 33.65,22 34.05,22.4 35.85,22.4 36.15,22.7 38.35,22.7 38.65,23 40.75,23 41.05,23.3 43.05,23.3 44.55,24.8 45.04,24.8 X4.2
PC10_51
  Top 0.15: UC1.P$51 24.45,24.2 24.75,24.5 24.75,28.6 26.25,30.1 28.35,30.1 28.65,30.4 31.25,30.4 31.55,30.7 33.6,30.7 33.9,31 38.3,31 39.1,31.8 39.7,32.4 X2.16
PC11_52
  Top 0.15: UC1.P$52 23.95,24.15 24.45,24.65 24.45,28.75 26.1,30.4 28.2,30.4 28.5,30.7 31.1,30.7 31.4,31 33.45,31 33.75,31.3 36,31.3 36.7,32 37.1,32.4 X2.15
PC12_DISC_53
  Top 0.15: T1.1 31.4,29.5 29.1,29.5 28.8,29.2 26.7,29.2 25.65,28.15 25.65,24.25 25.85,24.05 25.85,22.65 25.6,22.4 23.6,22.4 23.45,22.55 UC1.P$53 23.45,24.1 24.15,24.8 24.15,28.9 25.95,30.7 28.05,30.7 28.35,31 30.95,31 31.25,31.3 33.3,31.3 33.6,31.6 34.8,31.6 34.9,31.7 34.9,32.38 X2.14
PC13_2
  Top 0.15: UC1.P$2 15.1,20.65 13.9,19.45 10.05,19.45 10,19.5 10,22.3 9.2,23.1 5.1,23.1 4.9,23.3 4.9,30.9 5.5,31.5 6.08,31.5 X2.3
PD2_54
  Top 0.15: UC1.P$54 22.95,24.05 23.85,24.95 23.85,29.05 25.8,31 27.9,31 28.2,31.3 30.75,31.3 31.05,31.6 32.3,31.6 32.4,31.7 32.4,32.38 X2.13
SPI1_MISO_22
  Top 0.15: UC1.P$22 20.45,10.9 22.15,9.2 22.15,5.05 24.1,3.1 25.55,3.1 26.75,1.9 X1.11
SPI1_MOSI_23
  Top 0.15: UC1.P$23 20.95,10.85 22.45,9.35 22.45,5.2 24.25,3.4 28.2,3.4 29.7,1.9 X1.12
SPI1_NSS_20
  Top 0.15: UC1.P$20 19.45,10.95 21.55,8.85 21.55,4.75 22.4,3.9 22.4,1.9 X1.9
SPI1_SCK_21
  Top 0.15: R7.1 26.64,12.06 26.3,12.4 20.15,12.4 19.95,12.2 UC1.P$21 19.95,10.95 21.35,9.55 21.4,9.5 21.85,9.05 21.85,4.9 23.95,2.8 24.6,2.8 24.8,2.6 24.8,1.94 X1.10
SPI2_MISO_35
  Top 0.15: UC1.P$35 28.3,14.65 28.7,14.25 29.9,14.25 30.5,13.65 30.5,9 31.1,8.4 33,8.4 34.4,7 34.9,7 X3.6
SPI2_MOSI_36
  Top 0.15: UC1.P$36 28.25,15.15 28.85,14.55 30.05,14.55 30.8,13.8 30.8,9.15 31.25,8.7 33.15,8.7 33.45,8.4 35.5,8.4 36.9,7 37.44,7 X3.5
SPI2_NSS_33
  Top 0.15: UC1.P$33 29.6,13.65 29.9,13.35 29.9,7 29.86,7 X3.8
SPI2_SCK_34
  Top 0.15: UC1.P$34 28.35,14.15 28.55,13.95 29.75,13.95 30.2,13.5 30.2,8.85 32.1,6.95 32.35,6.95 X3.7
SWCLK_49
  Top 0.15: UC1.P$49 25.45,23.95 25.35,24.05 25.35,28.3 26.55,29.5 28.65,29.5 28.95,29.8 31.55,29.8 31.85,30.1 33.9,30.1 34.2,30.4 40.5,30.4 41.1,31 43.5,31 44.9,32.4 X2.18 | X2.18 45.06,32.42 | U$1.3 45.1,29.6 45.1,32.38 X2.18
SWDAT_46
  Top 0.15: UC1.P$46 28.5,20.15 29,20.65 29,22.15 30.95,24.1 30.95,25.65 31.6,26.3 32.35,26.3 32.5,26.45 32.5,28.7 32.65,28.85 33.8,28.85 34.55,29.6 43.25,29.6 43.5,29.35 43.5,28.6 43.9,28.2 49.5,28.2 50.2,28.9 50.2,29.6 | 50.2,29.6 50.2,32.36 X2.20 | 50.2,29.6 U$1.1
USART1_RX_43
  Top 0.15: UC1.P$43 28.35,18.65 29.9,20.2 29.9,21.7 31.1,22.9 33.2,22.9 33.6,23.3 35.4,23.3 36.9,24.8 37.42,24.8 X4.5
USART1_TX_42
  Top 0.15: UC1.P$42 28.3,18.15 30.2,20.05 30.2,21.55 31.25,22.6 33.35,22.6 33.75,23 35.55,23 35.85,23.3 38.05,23.3 39.55,24.8 39.96,24.8 X4.4
USART2_CTS_14
  Top 0.15: UC1.P$14 15.15,14.65 14.65,14.15 9.75,14.15 9.35,13.75 3.85,13.75 1.9,11.8 1.9,4.3 2.3,3.9 3.35,3.9 3.55,3.7 4.45,3.7 4.55,3.6 5.6,3.6 5.9,3.3 8.95,3.3 9.25,3 11.4,3 12,2.4 12,1.96 X1.5
USART2_RTS_15
  Top 0.15: UC1.P$15 15.15,14.15 14.85,13.85 9.9,13.85 9.5,13.45 4,13.45 2.2,11.65 2.2,4.45 2.45,4.2 3.5,4.2 3.7,4 4.6,4 4.7,3.9 5.75,3.9 6.05,3.6 9.1,3.6 9.4,3.3 11.55,3.3 11.85,3 13.5,3 X1.6
USART2_RX_17
  Top 0.15: UC1.P$17 17.95,10.7 18.45,10.2 18.45,4.7 19.65,3.5 19.65,2.65 19.7,2.6 19.7,1.92 X1.8
USART2_TX_16
  Top 0.15: UC1.P$16 15.15,13.65 15.05,13.55 10.05,13.55 9.65,13.15 4.15,13.15 2.5,11.5 2.5,4.6 2.6,4.5 3.65,4.5 3.85,4.3 4.75,4.3 4.85,4.2 5.9,4.2 6.2,3.9 9.25,3.9 9.55,3.6 11.7,3.6 12,3.3 13.65,3.3 13.85,3.1 15.3,3.1 15.4,3 16.5,1.9 X1.7
USBDM_44
  Top 0.15: UC1.P$44 28.4,19.15 29.6,20.35 29.6,21.85 30.95,23.2 33,23.2 34.6,24.8 34.88,24.8 X4.6 34.96,24.76 35,24.8 35.75,25.55 IC1.3
USBDP_45
  Top 0.15: UC1.P$45 28.45,19.65 29.3,20.5 29.3,22 32,24.7 32.3,24.7 32.4,24.7 32.38,24.72 X4.7 33.42,25.8 33.9,25.8 34.44,26.34 34.45,26.34 IC1.1
VBAT
  Top 0.15: UC1.P$1 15.15,21.15 13.8,19.8 12.84,19.8 C8.2 12.5,20 12.3,19.8 10.4,19.8 10.3,19.9 10.3,22.45 9.7,23.05 9.7,24.3 10.6,25.2 11.6,25.2 11.9,25.5 D4.3
VCC
  Top 0.3: 17.95,22.6 17.95,21.6 18.95,20.6 25.4,20.6 | 17.95,22.6 UC1.P$64 | 18.95,12.8 UC1.P$19 18.95,10.85 19.55,10.25 C15.2 | 25.4,20.6 25.4,14.2 25,13.8 25,12.8 | 25.4,20.6 26.85,22.05 26.85,27.05 27.1,27.3 28.3,27.3 28.3,26.6 | 28.3,26.6 28.3,25.9 28.2,25.8 27.75,25.8 27.65,25.7 27.65,21.2 UC1.P$48 | UC1.P$32 25.45,10.8 26.7,10.8 | 26.7,10.8 27.4,10.8 27.4,12 26.6,12.8 25,12.8 | 18.95,12.8 25,12.8 | 17.95,22.6 17,22.6 | 17,22.6 16.4,22.6 15.95,23.05 | T1.2 31.25,27.1 30.3,27.1 30,27.1 29.7,27.1 29.5,27.1 29.2,26.8 29.1,26.7 C6.2 28.34,26.64 28.3,26.6 | 18.95,12.8 17.5,12.8 16.5,11.8 15.32,11.8 C16.1 15.27,10.33 IC4.2 15.1,9 C4.A | 26.7,10.8 C7.2 | 17,22.6 C14.2 | R8.2 15.9,23.1 15.95,23.05 | 15.95,23.05 16.1,23.2 16.1,25.2 15.64,25.66 R3.1 14.2,26.3 D4.2
VCC_IN
  Top 0.3: Q1.1 13.9,4.55 | Q1.1 14.95,4.65 D5.A 17.18,4.2 C17.1 17.2,4.28 17.22,4.3 17.4,4.3 18.4,3.3 18.4,0.8 18.75,0.45 51,0.45 51.6,1.05 51.6,5.9 51.1,6.4 48.7,6.4 48.12,6.98 X3.1 47.6,7 47.6,7.7 46.3,9 45.7,9 44.5,10.2 D2.C 43.2,11.1 D3.C 40.41,12.79 IC6.3 | IC5.4 8.35,6.35 8.95,6.95 11.4,6.95 11.95,6.4 12.4,6.4 12.7,6.1 12.7,4.9 | Q1.1 13.85,4.5 | Q1.1 14,4.6 | IC5.1 11.15,4.45 11.2,4.5 11.4,4.5 11.8,4.9 12.7,4.9 | 12.7,4.9 13.75,4.9 Q1.1
VDD
  Top 0.3: C5.2 UC1.P$13 16.55,15.15 16.9,14.8 16.9,13.5 16.5,13.1 12.45,13.1 11.6,12.25 11.6,12.2 11.22,11.82 C18.1 11.2,11.73 11.2,11.1 10.8,10.7 8.3,10.7 7.5,9.9 IC3.2
(copper drawn outside any net)
  shapes: Top circle x2

### Text on the board
Top: V0.9.8 | Mini64 | R10
tPlace: SWCLK | SWDAT | RX | TX | Serial programmer
tNames: 49 | 48 | 47 | NRST | 46 | 45 | BOOT0 | 44 | 43 | 42 | 41 | 40 | 39 | 38 | 37 | 36 | 35 | 34 | GND | 33 | GND | SWD | GND | 26 | 27 | 28 | 29 | 30 | 31 | 32 | 25 | 24 | 23 | 22 | 21 | 20 | +3.3V | VIN | 1 | 2 | 3 | 4 | 5 | 6 | 7 | 8 | 9 | 10 | 11 | 12 | 13 | 14 | 15 | 16 | 17 | 18 | 19 | +3.3V
tValues: * C3/C11 | F103 - 1uF | F2x/4x - R0